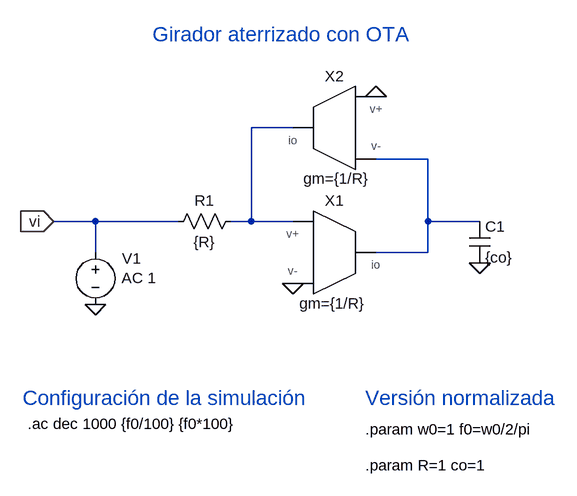
[diagram p0: schematic OTA girador.asc]
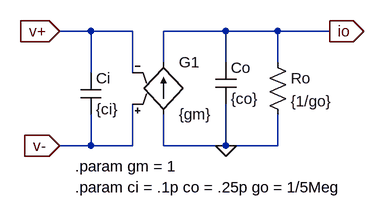
[diagram p1: sub-circuit ota.asc]
OTA girador.asc, the LTspice schematic file:
Version 4
SHEET 1 956 880
WIRE 416 -16 352 -16
WIRE 624 32 544 32
WIRE 112 128 48 128
WIRE 240 128 112 128
WIRE 352 128 352 -16
WIRE 352 128 320 128
WIRE 416 128 352 128
WIRE 624 128 624 32
WIRE 704 128 624 128
WIRE 112 176 112 128
WIRE 624 176 624 128
WIRE 624 176 544 176
FLAG 112 256 0
FLAG 48 128 vi
IOPIN 48 128 In
FLAG 416 224 0
FLAG 544 -64 0
FLAG 704 192 0
SYMBOL voltage 112 160 R0
WINDOW 123 40 55 Left 2
WINDOW 39 0 0 Left 0
WINDOW 0 41 25 Left 2
SYMATTR Value2 AC 1
SYMATTR InstName V1
SYMATTR Value ""
SYMBOL OTA 496 176 R0
WINDOW 39 -19 94 Bottom 2
SYMATTR SpiceLine gm={1/R}
SYMATTR InstName X1
SYMBOL OTA 464 -16 M0
WINDOW 39 -19 94 Bottom 2
SYMATTR SpiceLine gm={1/R}
SYMATTR InstName X2
SYMBOL cap 688 128 R0
SYMATTR InstName C1
SYMATTR Value {co}
SYMBOL res 336 112 R90
WINDOW 0 0 56 VBottom 2
WINDOW 3 32 56 VTop 2
SYMATTR InstName R1
SYMATTR Value {R}
TEXT 8 440 Left 2 !.ac dec 1000 {f0/100} {f0*100}
TEXT 528 504 Left 2 !.param R=1 co=1
TEXT 0 400 Left 3 ;Configuración de la simulación
TEXT 528 400 Left 3 ;Versión normalizada
TEXT 528 448 Left 2 !.param w0=1 f0=w0/2/pi
TEXT 200 -160 Left 3 ;Girador aterrizado con OTA

ota.asc, the sub-circuit schematic file:
Version 4
SHEET 1 880 680
WIRE -16 80 -64 80
WIRE 48 80 -16 80
WIRE 192 80 96 80
WIRE 272 80 192 80
WIRE 352 80 272 80
WIRE 96 128 96 80
WIRE 192 128 192 80
WIRE 272 128 272 80
WIRE -16 144 -16 80
WIRE 48 144 48 80
WIRE -16 256 -16 208
WIRE -16 256 -64 256
WIRE 48 256 48 192
WIRE 48 256 -16 256
WIRE 96 256 96 208
WIRE 192 256 192 192
WIRE 192 256 96 256
WIRE 272 256 272 208
WIRE 272 256 192 256
FLAG 352 80 io
IOPIN 352 80 Out
FLAG -64 80 v+
IOPIN -64 80 In
FLAG -64 256 v-
IOPIN -64 256 In
FLAG 192 256 0
SYMBOL cap -32 144 R0
SYMATTR InstName Ci
SYMATTR Value {ci}
SYMATTR SpiceLine Rser=0
SYMBOL cap 176 128 R0
SYMATTR InstName Co
SYMATTR Value {co}
SYMATTR SpiceLine Rser=0
SYMBOL res 256 112 R0
SYMATTR InstName Ro
SYMATTR Value {1/go}
SYMBOL g2 96 112 R0
SYMATTR InstName G1
SYMATTR Value {gm}
TEXT -40 288 Left 2 !.param gm = 1
TEXT -40 320 Left 2 !.param ci = .1p co = .25p go = 1/5Meg

The netlist it stands for:
* OTA girador.asc
V1 vi 0 AC 1
XX1 N002 N001 0 ota params: gm={1/R}
XX2 N001 0 N002 ota params: gm={1/R}
C1 N002 0 {co}
R1 N001 vi {R}

* block symbol definitions
.subckt ota io v+ v-
Ci v+ v- {ci} Rser=0
Co io 0 {co} Rser=0
Ro io 0 {1/go}
G1 0 io v- v+ {gm}
.param gm = 1
.param ci = .1p co = .25p go = 1/5Meg
.ends ota

.ac dec 1000 {f0/100} {f0*100}
.param R=1 co=1
* Configuración de la simulación
* Versión normalizada
.param w0=1 f0=w0/2/pi
* Girador aterrizado con OTA
.backanno
.end